# EAGLE design synth-zodiac-capricorn-vcf-mod (EAGLE 9.6.2)
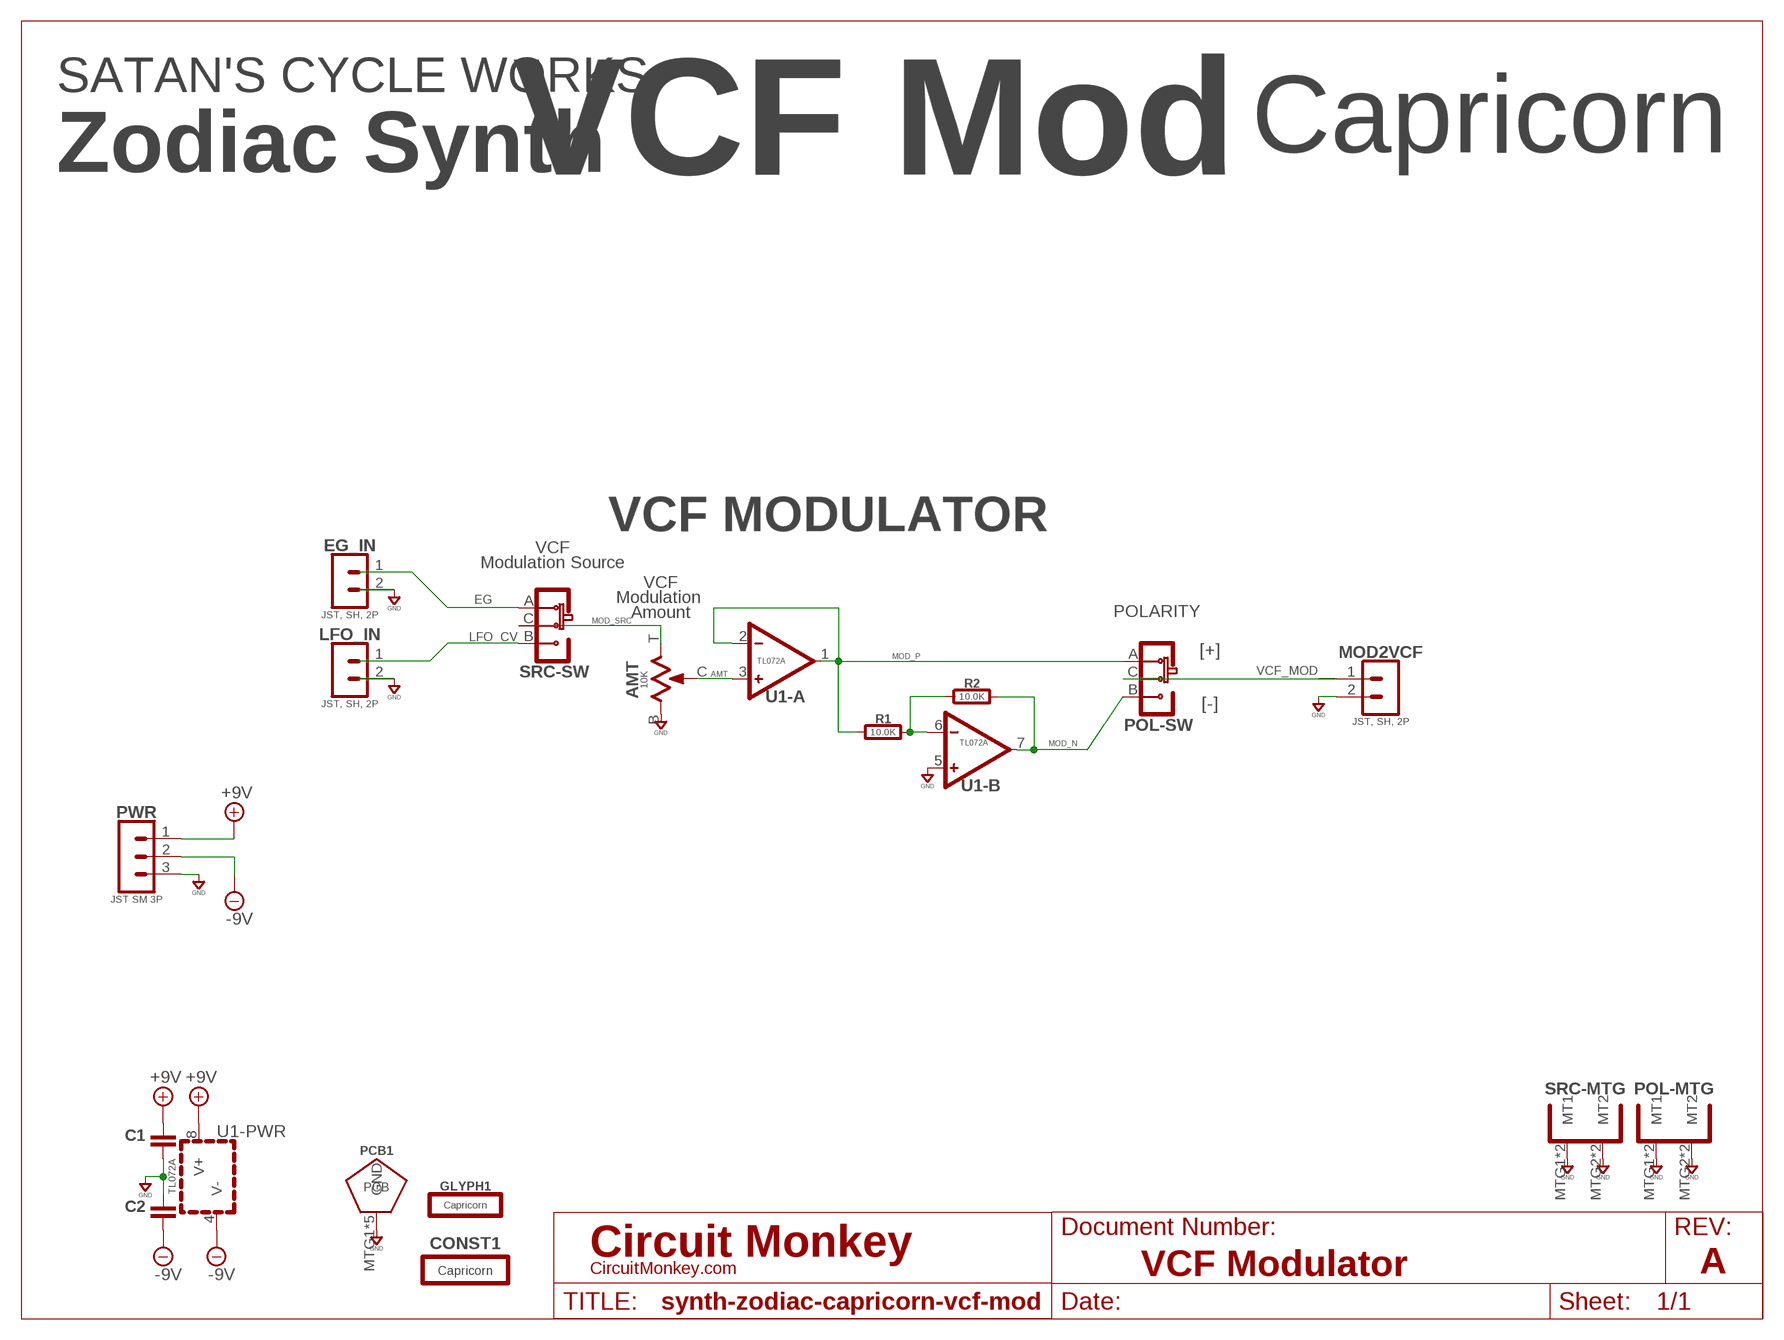
[diagram p0: schematic, sheet 1]
SHEET3 (LETTER_L-CIRCUITMONKEY): DOCUMENT_NUMBER: VCF Modulator; REV: A

## Parts
AMT  10K  TRIMPOT9MM_PCB_SHAFT  [POT-RV9110]
C1  0.1uF  CAPACITOR0603  [0603-CAP]
C2  0.1uF  CAPACITOR0603  [0603-CAP]
CONST1  Capricorn  CONSTELLATION-CAPRICORN  [CAPRICORN-CONST]
EG_IN  JST, SH, 2P  02P-SM-VT-SMT  [BM02B-SRSS-TB]
GLYPH1  Capricorn  GLYPH-CAPRICORN  [CAPRICORN-GLYPH]
LFO_IN  JST, SH, 2P  02P-SM-VT-SMT  [BM02B-SRSS-TB]
MOD2VCF  JST, SH, 2P  02P-SM-VT-SMT  [BM02B-SRSS-TB]
PCB1  PCB FAB  PENTAGON-40R  [PENTAGON-40MM-RAD]
POL  SLIDE-SPDT-MNTSS-12-F45-TH-PCB-2  [SS-12-F45-PNL-SMT-2]
PWR  JST SM 3P  03P-SM-VT-SMT  [BM03B-SRSS-TB]
R1  10.0K  RESISTOR0603  [0603-RES]
R2  10.0K  RESISTOR0603  [0603-RES]
SRC  SLIDE-SPDT-MNTSS-12-F45-TH-PCB-2  [SS-12-F45-PNL-SMT-2]
U1  TL072A  DUALTL072A  [SOP08]

## Nets
+9V: C1.1 PWR.1 U1.8(-PWR:V+)
-9V: C2.2 PWR.2 U1.4(-PWR:V-)
AMT: AMT.C U1.3(-A:+)
EG: EG_IN.1 SRC.A(-SW:A)
GND: AMT.B C1.2 C2.1 EG_IN.2 LFO_IN.2 MOD2VCF.2 PCB1.MTG1(GND) PCB1.MTG2(GND) PCB1.MTG3(GND) PCB1.MTG4(GND) PCB1.MTG5(GND) POL.MTG1(-MTG:MT1) POL.MTG2(-MTG:MT2) POL.MTG3(-MTG:MT1) POL.MTG4(-MTG:MT2) PWR.3 SRC.MTG1(-MTG:MT1) SRC.MTG2(-MTG:MT2) SRC.MTG3(-MTG:MT1) SRC.MTG4(-MTG:MT2) U1.5(-B:+)
LFO_CV: LFO_IN.1 SRC.B(-SW:B)
MOD_N: POL.B(-SW:B) R2.2 U1.7(-B:OUT)
MOD_P: POL.A(-SW:A) R1.1 U1.1(-A:OUT) U1.2(-A:-)
MOD_SRC: AMT.T SRC.C(-SW:C)
N$99: R1.2 R2.1 U1.6(-B:-)
VCF_MOD: MOD2VCF.1 POL.C(-SW:C)

## Notes on the sheet
- VCF Mod | Capricorn
- SATAN'S CYCLE WORKS
- Zodiac Synth
- VCF MODULATOR
- VCF
  Modulation Source
- POLARITY
- VCF
  Modulation 
  Amount
- [+]
- [-]

## Library data of the parts
AMT = rlc:TRIMPOT: Potentiometer; COST01: 0.70; COST10: 0.60; COST100: 0.60; MFR: Tayda; MPN: RV9110NO-OS15A00; SKU: A-5517
C1 C2 = rlc:CAPACITOR: Capacitor; COST01: 0.12; COST10: 0.09; COST100: 0.05
CONST1 = circuit-monkey-zodiac:CONSTELLATION: Constellations
EG_IN LFO_IN MOD2VCF = con-jst:02P: 2 pin connector; COST01: 0.45; COST10: 0.4; COST100: 0.35; MFR: JST; MPN: BMB02B-SRSS-TB
GLYPH1 = circuit-monkey-zodiac:GLYPH: Glyph
PCB1 = circuit-monkey-zodiac:PENTAGON: Pentagram shaped PCB
POL SRC = switch-thd:SLIDE-SPDT-MNT: Slide Switch, SPDT; COST01: 0.15; COST10: 0.12; COST100: 0.12; MFR: Tayda; MPN: A-659/A-5111/A-5104
PWR = con-jst:03P: 3 pin connector; COST01: 0.60; COST10: 0.45; COST100: 0.38; MFR: JST; MPN: BM03B-SRSS-TB
R1 R2 = rlc:RESISTOR: Resistor; COST01: 0.10; COST10: 0.05; COST100: 0.02
U1 = op-amp:DUAL: Dual Op-Amp; COST01: 0.65; COST10: 0.55; COST100: 0.45; MFR: ST; MPN: TL072A

## Board
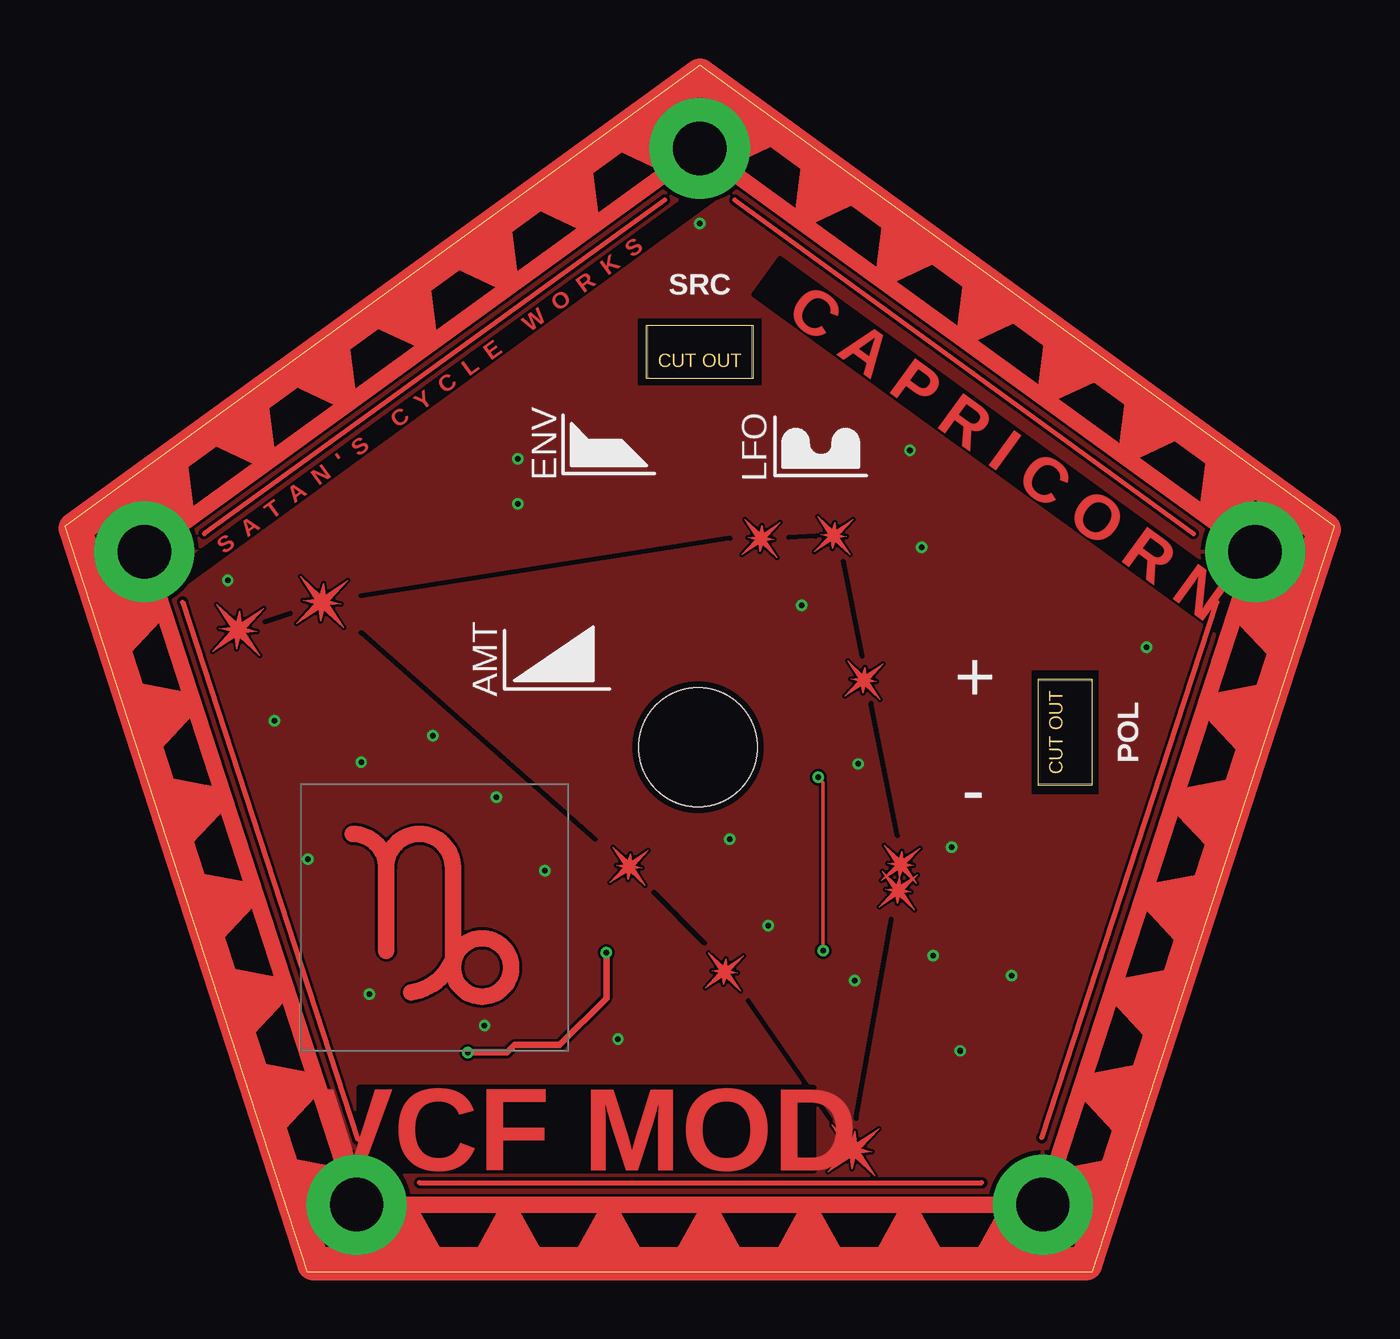
[diagram p1: board, top side]
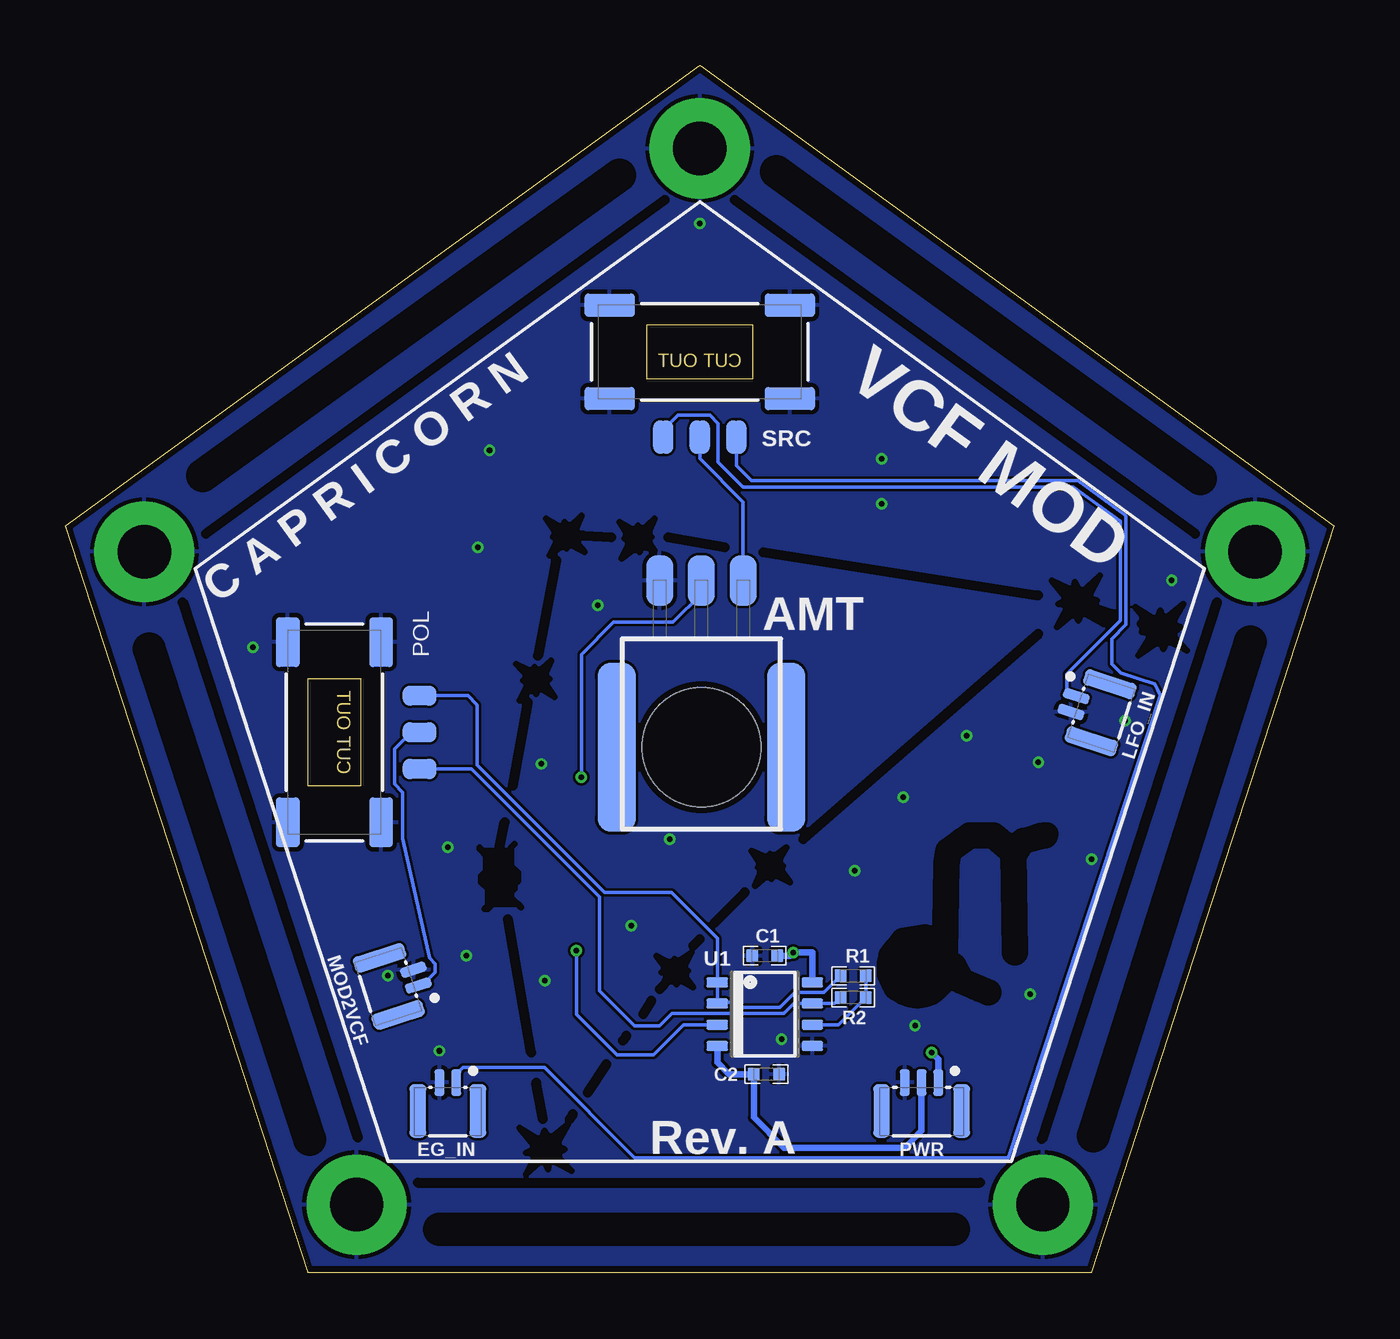
[diagram p2: board, bottom side, seen from below]

Size 76.08 x 72.36 mm. Coordinates in mm from the lower left corner, seen from the top.
Copper layers (1*16): Top 0.0356mm / dielectric 1.5011mm / Bottom 0.0356mm
Design rules "OSH-CircuitMonkey *": minimum track width 6mil, minimum drill 13mil, track to track 6mil, track to pad 6mil, pad to pad 6mil, via to via 6mil, smd to smd 6mil, copper to edge 15mil, drill to drill 6mil, minimum pad ring 7mil, minimum via ring 7mil, stop-mask expansion 3mil, vias tented up to drill 15mil, thermal gap 10mil
bRestrict: area 48.7,21.8 to 51.2,25.7; area 45.7,5.9 to 48.8,8.9; area 38.4,16.9 to 40.6,19.2; area 32.6,23.2 to 34.9,25.5; area 8.8,37 to 11.9,40.1; area 13.8,38.7 to 16.9,41.8; area 40.7,42.8 to 42.8,45.2; area 44.9,43 to 47.2,45.4; area 46.7,34.3 to 49,36.7; 38 lines

### Footprints (pad centres in the part's own frame; a part is rotated, then mirrored left to right if it is on the bottom)
POT-RV9110 = smd 1.6 x 3: B 2.5,-10; C 0,-10; T -2.5,-10 | smd 2.286 x 10.16: MNT1 -5.08,0; MNT2 5.08,0 | hole 7.1: 0,0
0603-CAP = smd 0.711 x 0.762: 1 -0.752,0; 2 0.752,0
BM02B-SRSS-TB = smd 0.6 x 1.6: 1 -0.5,-0.3; 2 0.5,-0.3 | smd 1 x 3.2: MTG1 1.8,1.4; MTG2 -1.8,1.4
PENTAGON-40MM-RAD = drill 3.2 pad 6: MTG1 0,35; MTG2 33.3,10.82; MTG3 20.57,-28.32; MTG4 -20.57,-28.32; MTG5 -33.3,10.82
SS-12-F45-PNL-SMT-2 = smd 1.2 x 2 bottom: A -2.2,-5.1; B 2.2,-5.1; C 0,-5.1 | smd 3 x 1.4 bottom: MTG1 -5.4,2.8; MTG2 5.4,2.8; MTG3 -5.4,-2.8; MTG4 5.4,-2.8
BM03B-SRSS-TB = smd 0.6 x 1.6: 1 -1,-0.3; 2 0,-0.3; 3 1,-0.3 | smd 1 x 3.2: MTG1 2.4,1.4; MTG2 -2.4,1.4
0603-RES = smd 0.711 x 0.762: 1 -0.752,0; 2 0.752,0
SOP08 = smd 0.6 x 1.3: 1 -1.905,-2.85; 2 -0.635,-2.85; 3 0.635,-2.85; 4 1.905,-2.85; 5 1.905,2.85; 6 0.635,2.85; 7 -0.635,2.85; 8 -1.905,2.85

### Placement (x,y rotation side)
AMT  37.94,31.46 180 bottom
C1  34.14,18.96 180 bottom
C2  34.04,11.86 180 bottom
CONST1  38.38,32.58 220 top
EG_IN  53.14,11.06 180 bottom
GLYPH1  22.24,21.26 0 top
LFO_IN  15.34,33.96 252 bottom
MOD2VCF  55.34,17.56 108 bottom
PCB1  38.04,32.36 0 top
POL  59.94,32.36 270 top
PWR  24.74,11.06 180 bottom
R1  28.84,17.76 0 bottom
R2  28.84,16.46 180 bottom
SRC  38.04,55.16 0 top
U1  34.14,15.46 270 bottom

### Tracks (layer width: path | path; a pad name or v marks a point on that pad's centre or on a via)
+9V  (via drill 0.33)
  Top 0.4: v32.44,19.16 32.44,16.41 29.64,13.61 26.94,13.61 26.49,13.16 v24.14,13.16
  Bottom 0.4: U1.8 31.29,19.16 v32.44,19.16 32.64,18.96 C1.1 | PWR.1 23.74,12.76 v24.14,13.16
-9V
  Bottom 0.4: U1.4 36.99,12.56 36.29,11.86 C2.2 34.79,9.26 32.99,7.46 25.74,7.46 24.74,8.46 PWR.2
AMT  (via drill 0.33)
  Top 0.2: v45.44,19.26 45.44,29.36 v45.14,29.66
  Bottom 0.2: U1.3 39.01,14.83 40.81,13.03 43.01,13.03 45.44,15.46 v45.44,19.26 | AMT.C 37.94,40.66 39.64,38.96 43.2,38.96 45.14,37.02 v45.14,29.66
EG
  Bottom 0.2: EG_IN.1 52.64,11.86 52.24,12.26 47.34,12.26 41.94,6.86 19.54,6.86 10.44,34.56 10.62,34.97 10.77,35.26 12.8,35.91 13.34,36.46 13.34,37.96 12.49,38.81 12.49,45.32 12.59,45.42 15.39,47.46 34.94,47.46 35.84,48.36 SRC.A
GND  (via drill 0.33)
  other vias: 22.04,32.16 25.84,28.46 28.74,24.06 12.54,33.06 33.14,13.96 9.74,41.46 27.14,46.06 27.14,48.76 38.04,62.86 50.64,49.26 51.34,43.46 64.84,37.46 53.14,25.46 53.64,13.26 47.34,17.46 47.54,30.46 44.14,39.96 18.24,16.66 17.74,30.56 52.04,18.96 56.74,17.76 25.14,14.76 14.54,24.76 39.84,25.96 42.14,20.76
  pour Bottom: 61.54,0.06 14.54,0.06 0.04,44.76 38.04,72.36 76.04,44.76
  pour Top (rank 2): 17.44,3.96 58.64,4.16 71.24,43.16 38.04,67.16 4.84,43.16
LFO_CV
  Bottom 0.2: LFO_IN.1 15.54,34.46 16.04,34.96 16.04,35.86 12.84,39.06 12.84,45.02 15.64,47.06 35.44,47.06 36.94,48.56 36.94,50.86 37.44,51.36 39.34,51.36 40.24,50.46 SRC.B
MOD_N
  Bottom 0.2: R2.2 29.96,16.1 U1.7 32.39,16.1 32.99,15.5 39.71,15.5 40.44,14.76 41.94,14.76 44.04,16.86 44.04,22.48 51.72,30.16 POL.B
MOD_P
  Bottom 0.2: U1.2 36.99,16.16 | 36.99,16.16 U1.1 36.99,20.01 39.74,22.76 43.75,22.76 51.39,30.4 51.39,34.01 51.94,34.56 POL.A | R1.1 30.59,16.77 32.34,16.77 33.24,15.86 35.74,15.86 36.04,16.16 36.99,16.16
MOD_SRC
  Bottom 0.2: AMT.T 35.44,46.16 38.04,48.76 SRC.C
N$99
  Bottom 0.2: U1.6 29.73,14.83 R2.1 R1.2
VCF_MOD
  Bottom 0.2: MOD2VCF.1 54.7,17.18 53.9,17.98 53.9,18.48 54.25,18.82 55.84,26 55.84,28.76 56.34,29.26 56.34,31.36 55.34,32.36 POL.C

### Text on the board
Top: S A T A N ' S C Y C L E W O R K S | C A P R I C O R N | VCF MOD
tPlace: ENV | LFO | + | -
bPlace: VCF MOD | C A P R I C O R N | Rev. A
tStop: S A T A N ' S C Y C L E W O R K S | C A P R I C O R N | VCF MOD